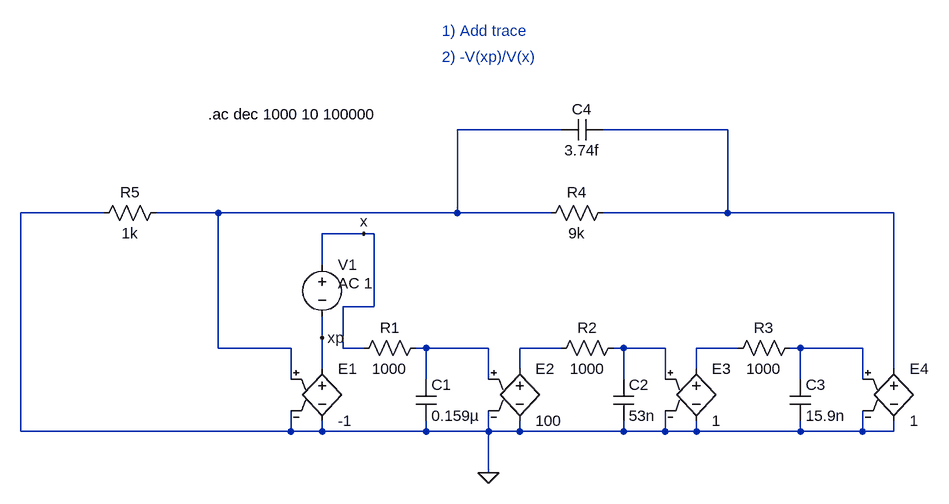
[diagram p0: schematic ganacia de lazo.asc]
ganacia de lazo.asc, the LTspice schematic file:
Version 4
SHEET 1 924 680
WIRE -208 -416 -368 -416
WIRE 48 -416 -144 -416
WIRE -912 -288 -1040 -288
WIRE -736 -288 -832 -288
WIRE -368 -288 -368 -416
WIRE -368 -288 -736 -288
WIRE -224 -288 -368 -288
WIRE 48 -288 48 -416
WIRE 48 -288 -144 -288
WIRE 304 -288 48 -288
WIRE -512 -256 -576 -256
WIRE -496 -256 -512 -256
WIRE -576 -208 -576 -256
WIRE -496 -144 -496 -256
WIRE -496 -144 -544 -144
WIRE -576 -96 -576 -128
WIRE -736 -80 -736 -288
WIRE -624 -80 -736 -80
WIRE -544 -80 -544 -144
WIRE -512 -80 -544 -80
WIRE -416 -80 -432 -80
WIRE -320 -80 -416 -80
WIRE -208 -80 -272 -80
WIRE -112 -80 -128 -80
WIRE -48 -80 -112 -80
WIRE 64 -80 0 -80
WIRE 160 -80 144 -80
WIRE 256 -80 160 -80
WIRE -576 -48 -576 -96
WIRE -272 -48 -272 -80
WIRE 0 -48 0 -80
WIRE 304 -48 304 -288
WIRE -624 -32 -624 -80
WIRE -416 -32 -416 -80
WIRE -320 -32 -320 -80
WIRE -112 -32 -112 -80
WIRE -48 -32 -48 -80
WIRE 160 -32 160 -80
WIRE 256 -32 256 -80
WIRE -1040 48 -1040 -288
WIRE -624 48 -624 16
WIRE -624 48 -1040 48
WIRE -576 48 -576 32
WIRE -576 48 -624 48
WIRE -416 48 -416 32
WIRE -416 48 -576 48
WIRE -320 48 -320 16
WIRE -320 48 -416 48
WIRE -272 48 -272 32
WIRE -272 48 -320 48
WIRE -112 48 -112 32
WIRE -112 48 -272 48
WIRE -48 48 -48 16
WIRE -48 48 -112 48
WIRE 0 48 0 32
WIRE 0 48 -48 48
WIRE 160 48 160 32
WIRE 160 48 0 48
WIRE 256 48 256 16
WIRE 256 48 160 48
WIRE 304 48 304 32
WIRE 304 48 256 48
WIRE -320 112 -320 48
FLAG -320 112 0
FLAG -576 -96 xp
FLAG -512 -256 x
SYMBOL e -576 -64 R0
SYMATTR InstName E1
SYMATTR Value -1
SYMBOL res -416 -96 R90
WINDOW 0 0 56 VBottom 2
WINDOW 3 32 56 VTop 2
SYMATTR InstName R1
SYMATTR Value 1000
SYMBOL cap -432 -32 R0
SYMATTR InstName C1
SYMATTR Value 0.159µ
SYMBOL e -272 -64 R0
SYMATTR InstName E2
SYMATTR Value 100
SYMBOL res -112 -96 R90
WINDOW 0 0 56 VBottom 2
WINDOW 3 32 56 VTop 2
SYMATTR InstName R2
SYMATTR Value 1000
SYMBOL cap -128 -32 R0
SYMATTR InstName C2
SYMATTR Value 53n
SYMBOL e 0 -64 R0
SYMATTR InstName E3
SYMATTR Value 1
SYMBOL res 160 -96 R90
WINDOW 0 0 56 VBottom 2
WINDOW 3 32 56 VTop 2
SYMATTR InstName R3
SYMATTR Value 1000
SYMBOL cap 144 -32 R0
SYMATTR InstName C3
SYMATTR Value 15.9n
SYMBOL e 304 -64 R0
SYMATTR InstName E4
SYMATTR Value 1
SYMBOL res -128 -304 R90
WINDOW 0 0 56 VBottom 2
WINDOW 3 32 56 VTop 2
SYMATTR InstName R4
SYMATTR Value 9k
SYMBOL res -816 -304 R90
WINDOW 0 0 56 VBottom 2
WINDOW 3 32 56 VTop 2
SYMATTR InstName R5
SYMATTR Value 1k
SYMBOL cap -144 -432 R90
WINDOW 0 0 32 VBottom 2
WINDOW 3 32 32 VTop 2
SYMATTR InstName C4
SYMATTR Value 3.74f
SYMBOL voltage -576 -224 R0
WINDOW 123 24 44 Left 2
WINDOW 39 0 0 Left 2
SYMATTR Value2 AC 1
SYMATTR InstName V1
SYMATTR Value ""
TEXT -752 -440 Left 2 !.ac dec 1000 10 100000
TEXT -392 -568 Left 2 ;1) Add trace
TEXT -392 -528 Left 2 ;2) -V(xp)/V(x)

The netlist it stands for:
* ganacia de lazo.asc
E1 xp 0 N001 0 -1
R1 N003 x 1000
C1 N003 0 0.159µ
E2 N004 0 N003 0 100
R2 N005 N004 1000
C2 N005 0 53n
E3 N006 0 N005 0 1
R3 N007 N006 1000
C3 N007 0 15.9n
E4 N002 0 N007 0 1
R4 N002 N001 9k
R5 N001 0 1k
C4 N002 N001 3.74f
V1 x xp AC 1
.ac dec 1000 10 100000
* 1) Add trace
* 2) -V(xp)/V(x)
.backanno
.end